# EAGLE design Moteino (EAGLE 6.5.0)
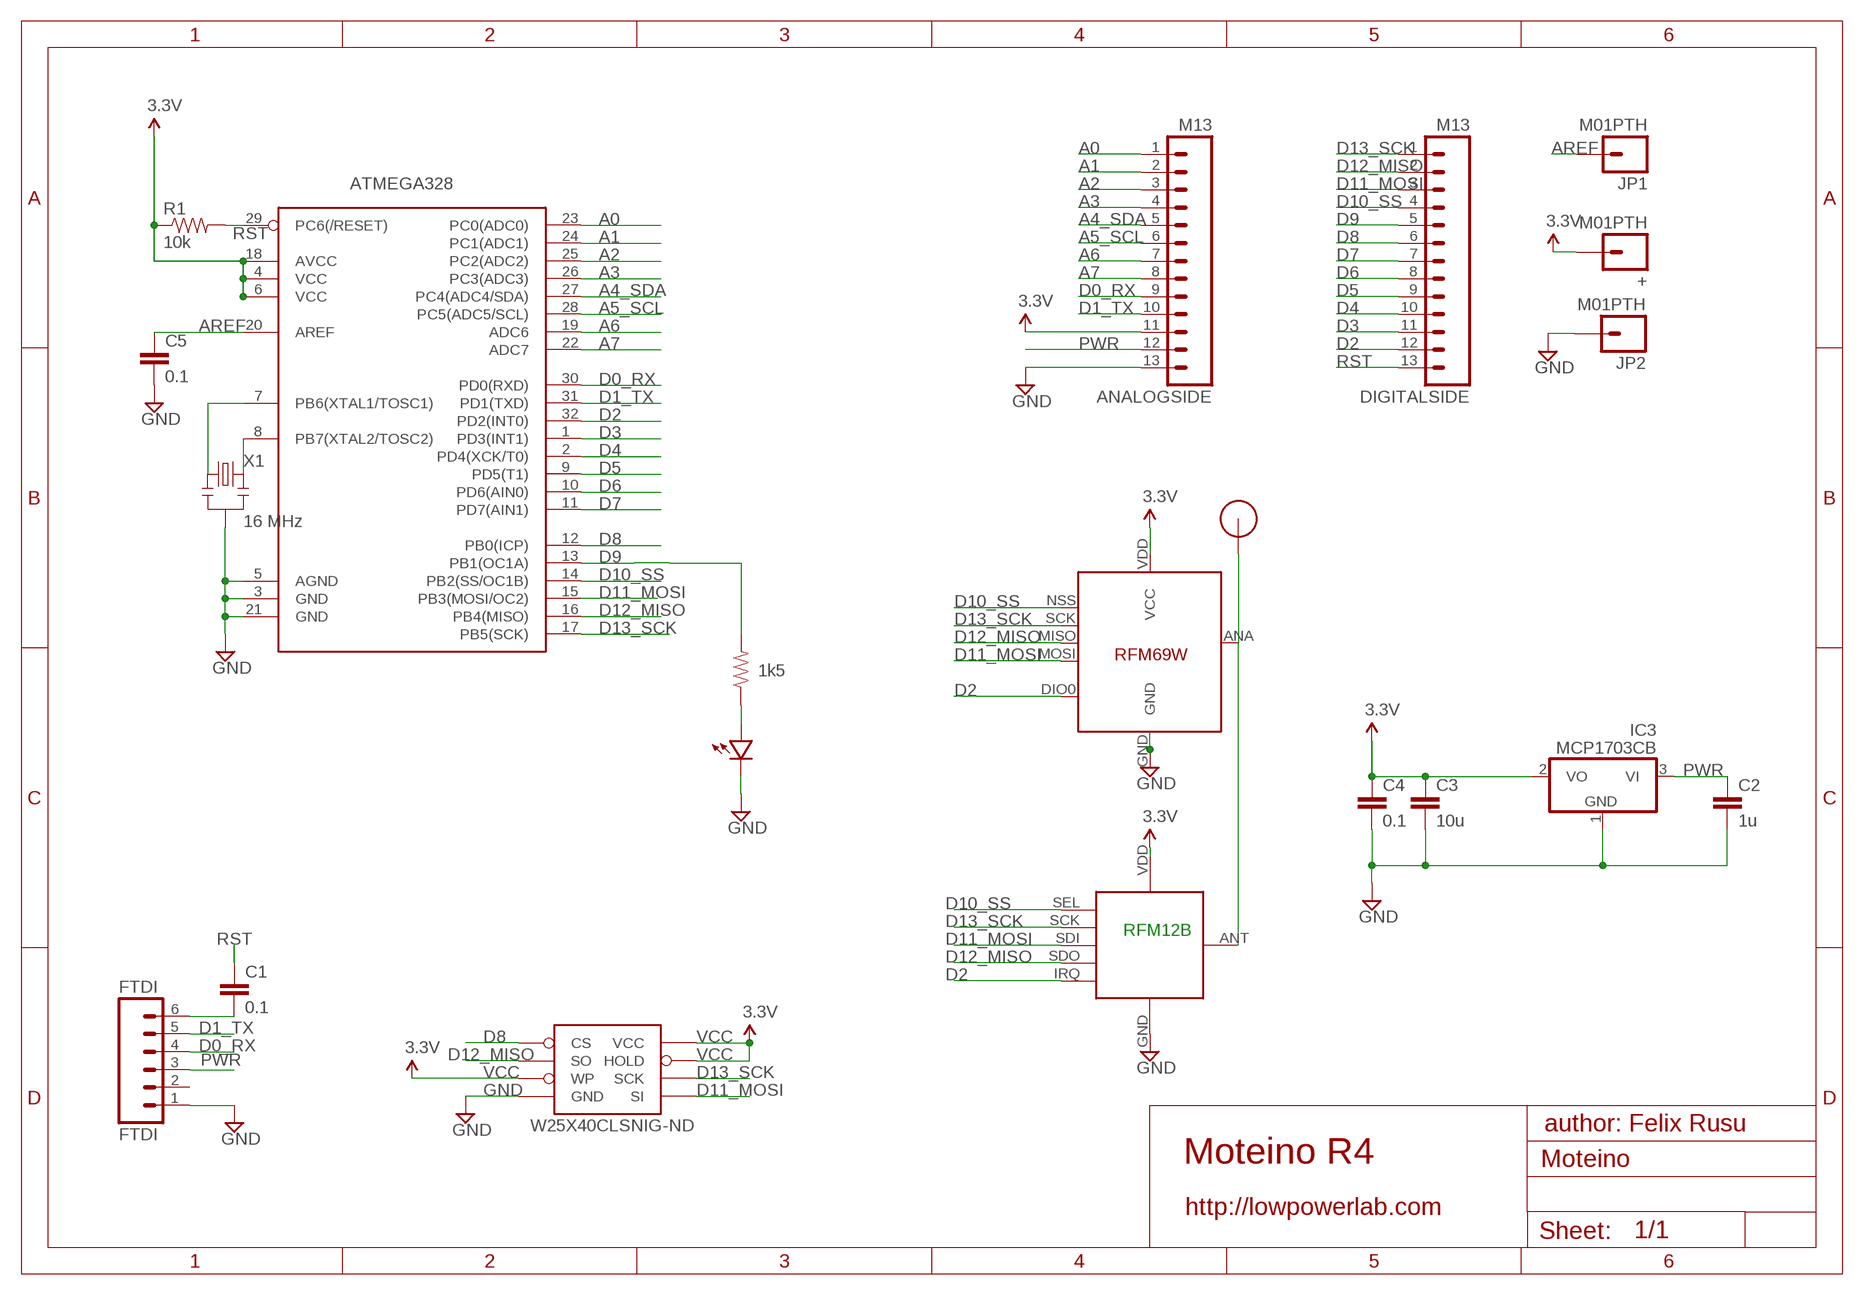
[diagram p0: schematic, sheet 1]

## Parts
+  M01PTH  [1X01]
ANALOGSIDE  M13  [1X13]
ATMEGA328  ATMega-328  ATMEGA168/328TQFP32  [TQFP32-08]
C1  0.1  CAP0603-CAP  [0603-CAP]
C2  1u  CAP0603-CAP  [0603-CAP]
C3  10u  CAP0805-CAP  [0805-CAP]
C4  0.1  CAP0603-CAP  [0603-CAP]
C5  0.1  CAP0603-CAP  [0603-CAP]
DIGITALSIDE  M13  [1X13]
FTDI  FTDI  M06SIP  [1X06]
IC3  MCP1703CB  [SOT23]
JP1  M01PTH  [1X01]
JP2  M01PTH  [1X01]
R1  10k  RESISTOR0603-RES  [0603-RES]
R2  1k5  RESISTOR0603-RES  [0603-RES]
RFM12B  RFM12B_MINPADS  [RFM12B-MINPADS]
U$1  RFM12B_ANTENNA  [RFM12B-ANTENNA]
U$2  LED0603  [0603-LED]
U$5  RFM69  [RFM69W-MINPADS]
W25X40CLSNIG-ND  AT25F512BWIDE_5.3MM  [SO08WIDE]
X1  16 MHz  RESONATORSMD  [RESONATOR-SMD]

## Nets
A0: ANALOGSIDE.1 ATMEGA328.23(PC0(ADC0))
A1: ANALOGSIDE.2 ATMEGA328.24(PC1(ADC1))
A2: ANALOGSIDE.3 ATMEGA328.25(PC2(ADC2))
A3: ANALOGSIDE.4 ATMEGA328.26(PC3(ADC3))
A4_SDA: ANALOGSIDE.5 ATMEGA328.27(PC4(ADC4/SDA))
A5_SCL: ANALOGSIDE.6 ATMEGA328.28(PC5(ADC5/SCL))
A6: ANALOGSIDE.7 ATMEGA328.19(ADC6)
A7: ANALOGSIDE.8 ATMEGA328.22(ADC7)
AREF: ATMEGA328.20(AREF) C5.1 JP1.1
D0_RX: ANALOGSIDE.9 ATMEGA328.30(PD0(RXD)) FTDI.4
D1_TX: ANALOGSIDE.10 ATMEGA328.31(PD1(TXD)) FTDI.5
D2: ATMEGA328.32(PD2(INT0)) DIGITALSIDE.12 RFM12B.IRQ U$5.DIO0
D3: ATMEGA328.1(PD3(INT1)) DIGITALSIDE.11
D4: ATMEGA328.2(PD4(XCK/T0)) DIGITALSIDE.10
D5: ATMEGA328.9(PD5(T1)) DIGITALSIDE.9
D6: ATMEGA328.10(PD6(AIN0)) DIGITALSIDE.8
D7: ATMEGA328.11(PD7(AIN1)) DIGITALSIDE.7
D8: ATMEGA328.12(PB0(ICP)) DIGITALSIDE.6 W25X40CLSNIG-ND.1(CS)
D9: ATMEGA328.13(PB1(OC1A)) DIGITALSIDE.5 R2.2
D10_SS: ATMEGA328.14(PB2(SS/OC1B)) DIGITALSIDE.4 RFM12B.SEL U$5.NSS(SEL)
D11_MOSI: ATMEGA328.15(PB3(MOSI/OC2)) DIGITALSIDE.3 RFM12B.SDI(SDI/MOSI) U$5.MOSI W25X40CLSNIG-ND.5(SI)
D12_MISO: ATMEGA328.16(PB4(MISO)) DIGITALSIDE.2 RFM12B.SDO(SDO/MISO) U$5.MISO W25X40CLSNIG-ND.2(SO)
D13_SCK: ATMEGA328.17(PB5(SCK)) DIGITALSIDE.1 RFM12B.SCK U$5.SCK W25X40CLSNIG-ND.6(SCK)
GND [power]: ANALOGSIDE.13 ATMEGA328.3(GND) ATMEGA328.5(AGND) ATMEGA328.21(GND) C2.2 C3.2 C4.2 C5.2 FTDI.1 IC3.1(GND) JP2.1 RFM12B.GND U$2.MINUS U$5.GND W25X40CLSNIG-ND.4(GND) X1.2
N$1: ATMEGA328.7(PB6(XTAL1/TOSC1)) X1.1
N$2: R2.1 U$2.PLUS
N$3: RFM12B.ANT U$1.P$1 U$5.ANA(ANT)
N$20: C1.2 FTDI.6
N$21: ATMEGA328.8(PB7(XTAL2/TOSC2)) X1.3
PWR [power]: ANALOGSIDE.12 C2.1 FTDI.3 IC3.3(VI)
RST: ATMEGA328.29(PC6(/RESET)) C1.1 DIGITALSIDE.13 R1.2
VCC: +.1 ANALOGSIDE.11 ATMEGA328.4(VCC) ATMEGA328.6(VCC) ATMEGA328.18(AVCC) C3.1 C4.1 IC3.2(VO) R1.1 RFM12B.VDD U$5.VDD(VCC) W25X40CLSNIG-ND.3(WP) W25X40CLSNIG-ND.7(HOLD) W25X40CLSNIG-ND.8(VCC) ; supply symbol labelled 3.3V
Unconnected: FTDI.2

## Notes on the sheet
- RFM12B
- author: Felix Rusu
- Moteino R4
- http://lowpowerlab.com

## Library data of the parts
+ JP1 JP2 = SparkFun-Connectors:M01: Header 1 Standard 1-pin 0.1" header. Use with straight break away headers (SKU : PRT-00116), right angle break away headers (PRT-00553), swiss pins (PRT-00743), machine pins (PRT-00117), and female headers (PRT-00115).
ANALOGSIDE DIGITALSIDE = SparkFun-Connectors:M13: 13-pin single row .1" header
ATMEGA328 = LowPowerLab:ATMEGA168/328: Atmel 32-pin 8-bit micro, 16k flash.
C1-C5 = LowPowerLab:CAP: Capacitor Standard 0603 ceramic capacitor, and 0.1" leaded capacitor.
FTDI = SparkFun-Connectors:M06: Header 6 Standard 6-pin 0.1" header. Use with straight break away headers (SKU : PRT-00116), right angle break away headers (PRT-00553), swiss pins (PRT-00743), machine pins (PRT-00117), and female headers (PRT-00115). Molex polarized connector foot print use with SKU : PRT-08094 with associated crimp pins and housings. NOTES ON THE VARIANTS LOCK and LOCK_LONGPADS... This footprint was designed to help hold the alignment of a through-hole component (i.e. 6-pin header) while soldering it into place. You may notice that each hole has been shifted either up or down by 0.005 of an inch from it's more standard position (which is a perfectly straight line). This slight alteration caused the pins (the squares in the middle) to touch the edges of the holes. Because they are alternating, it causes a "brace" to hold the component in place. 0.005 has proven to be the perfect amount of "off-center" position when using our standard breakaway headers. Although looks a little odd when you look at the bare footprint, once you have a header in there, the alteration is very hard to notice. Also, if you push a header all the way into place, it is covered up entirely on the bottom side. This idea of altering the position of holes to aid alignment will be further integrated into the Sparkfun Library for other footprints. It can help hold any component with 3 or more connection pins.
IC3 = linear:MCP1703: 250 mA, 16V, Low Quiescent Current LDO Regulator Source: http://ww1.microchip.com/downloads/en/DeviceDoc/22049b.pdf
R1 R2 = LowPowerLab:RESISTOR: Resistor Basic schematic elements and footprints for 0603, 1206, and PTH resistors.
RFM12B = LowPowerLab:RFM12B_MINPADS
U$1 = LowPowerLab:RFM12B_ANTENNA
U$2 = LowPowerLab:LED
U$5 = LowPowerLab:RFM69
W25X40CLSNIG-ND = LowPowerLab:AT25F512B: 4-Mbit SPI flash memory
X1 = SparkFun:RESONATOR: Resonator Small SMD resonator. This is the itty bitty 10/20MHz resonators with built in caps. CSTCE10M0G55 and CSTCE20M0V53. Footprint has been reviewed closely but hasn't been tested yet.

## Net classes
1 power: width 0.381 mm, clearance 0.254 mm

## Board
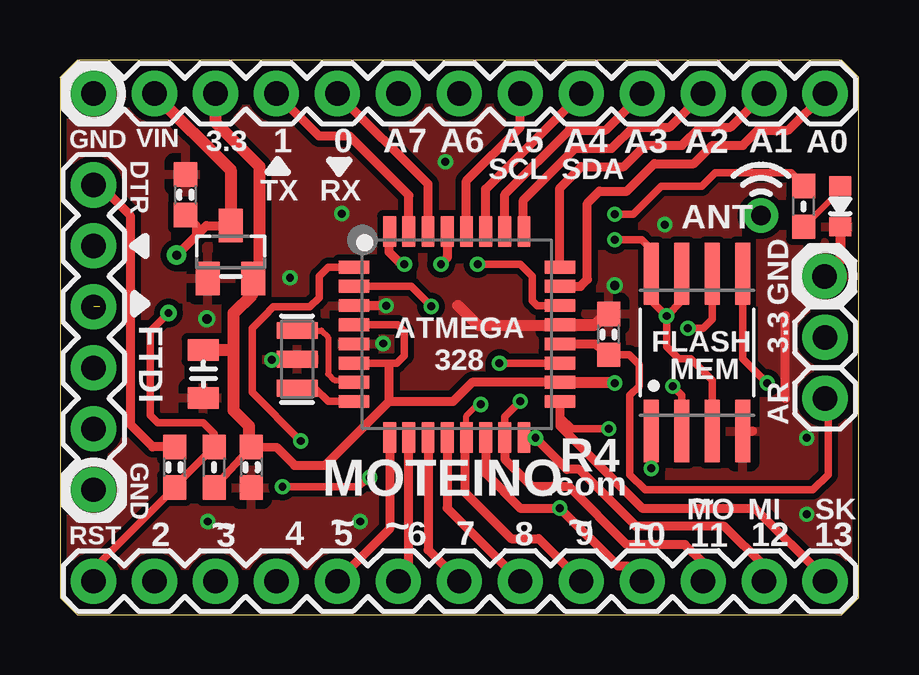
[diagram p1: board, top side]
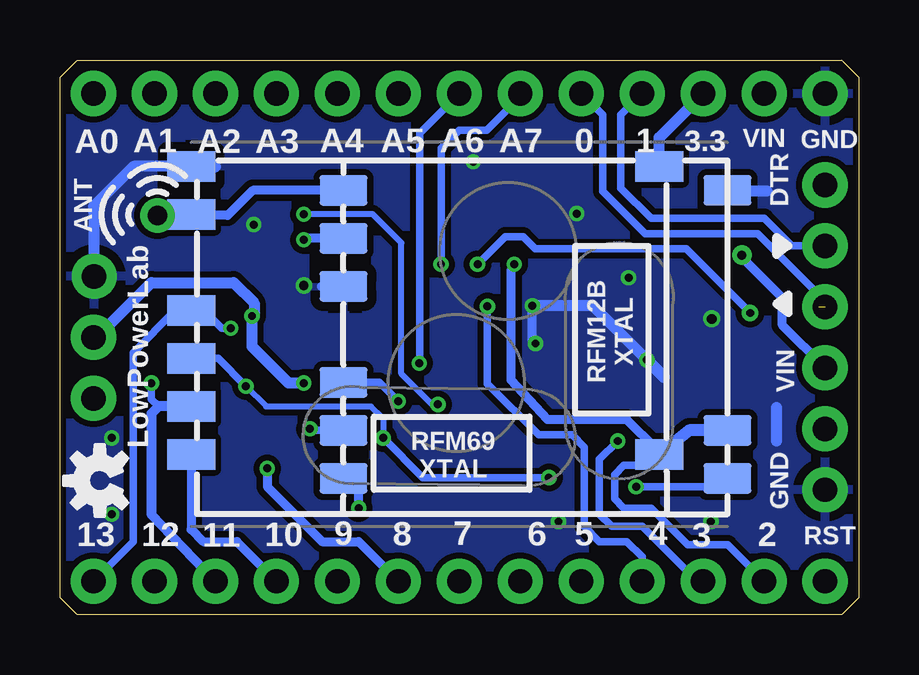
[diagram p2: board, bottom side, seen from below]

Size 33.27 x 23.11 mm. Coordinates in mm from the lower left corner, seen from the top.
Outline: 0.71,0 32.56,0 33.27,0.71 33.27,22.4 32.56,23.11 0.71,23.11 0,22.4 0,0.71 0.71,0
Copper layers (1*16): Top 0.035mm / dielectric 1.5mm / Bottom 0.035mm
Design rules "ITEADstudio_DRC *": minimum track width 6mil, minimum drill 12mil, track to track 6mil, track to pad 6mil, pad to pad 6mil, via to via 6mil, smd to smd 0mil, copper to edge 10mil, drill to drill 10mil, minimum pad ring 10mil, minimum via ring 6mil, stop-mask expansion 2mil, vias tented up to drill 100mil, thermal gap 15mil
tRestrict: area 24.3,8.9 to 29.1,12.8; area 5.8,16.9 to 6.9,18.5; area 5.2,9.7 to 6.7,10.4
bRestrict: area 27.4,17.7 to 29.2,18.7; area 21.1,13.8 to 22.9,14.9; area 21.6,12.6 to 22.1,13.2; area 20.7,12.6 to 21.2,13.2; area 20.2,12.8 to 20.7,13.5; area 20.1,13.4 to 20.6,14; area 26.5,18.9 to 27.1,19.5; area 26.5,17.9 to 27.1,18.5; area 27.5,19.1 to 28,19.8; area 27.9,18.8 to 29.1,19.6

### Footprints (pad centres in the part's own frame; a part is rotated, then mirrored left to right if it is on the bottom)
1X01 = drill 1.016 pad 1.88: 1 0,0
1X13 = drill 1.016 pad 1.88: 1 0,0; 2 2.54,0; 3 5.08,0; 4 7.62,0; 5 10.16,0; 6 12.7,0; 7 15.24,0; 8 17.78,0; 9 20.32,0; 10 22.86,0; 11 25.4,0; 12 27.94,0; 13 30.48,0
TQFP32-08 = smd 1.27 x 0.533: 1 -4.293,2.8; 2 -4.293,2; 3 -4.293,1.2; 4 -4.293,0.4; 5 -4.293,-0.4; 6 -4.293,-1.2; 7 -4.293,-2; 8 -4.293,-2.8; 17 4.293,-2.8; 18 4.293,-2; 19 4.293,-1.2; 20 4.293,-0.4; 21 4.293,0.4; 22 4.293,1.2; 23 4.293,2; 24 4.293,2.8 | smd 0.533 x 1.27: 9 -2.8,-4.293; 10 -2,-4.293; 11 -1.2,-4.293; 12 -0.4,-4.293; 13 0.4,-4.293; 14 1.2,-4.293; 15 2,-4.293; 16 2.8,-4.293; 25 2.8,4.293; 26 2,4.293; 27 1.2,4.293; 28 0.4,4.293; 29 -0.4,4.293; 30 -1.2,4.293; 31 -2,4.293; 32 -2.8,4.293
0603-CAP = smd 1.016 x 0.965: 1 -0.85,0; 2 0.85,0
0805-CAP = smd 0.902 x 1.3: 1 -1,0; 2 1,0
1X06 = drill 1.016 pad 1.88: 1 0,0; 2 2.54,0; 3 5.08,0; 4 7.62,0; 5 10.16,0; 6 12.7,0
SOT23 = smd 1 x 1.4: 1 -0.95,-1.1; 2 0.95,-1.1; 3 0,1.1
0603-RES = smd 1.016 x 0.965: 1 -0.85,0; 2 0.85,0
RFM12B-MINPADS = smd 2 x 1.27: ANT 8,-6; GND 8,-2; IRQ -8,4; SCK 8,4; SDI 8,2; SDI1 -8.002,-6.001; SDO -8,6; SEL 8,6; VDD 8,-4
RFM12B-ANTENNA = drill 0.8 pad 1.422: P$1 0,0
0603-LED = smd 0.8 x 0.9: MINUS -0.85,0; PLUS 0.85,0
RFM69W-MINPADS = smd 2 x 1.27: ANA 8,-5; DIO0 -11.5,5; GND 8,-7; MISO 8,1; MOSI 8,3; NSS 8,5; SCK 8,-1; VDD -11.5,-7
SO08WIDE = smd 0.61 x 2.6: 1 -1.905,-3.269; 2 -0.635,-3.269; 3 0.635,-3.269; 4 1.905,-3.269; 5 1.905,3.286; 6 0.635,3.286; 7 -0.635,3.286; 8 -1.905,3.286
RESONATOR-SMD = smd 0.7 x 1.7: 1 -1.2,0; 2 0,0; 3 1.2,0

### Placement (x,y rotation side)
+  31.88,11.56 270 top
ANALOGSIDE  31.88,21.72 180 top
ATMEGA328  16.54,11.68 0 top
C1  4.78,6.15 90 top
C2  5.23,17.5 90 top
C3  5.97,10.03 270 top
C4  7.98,6.15 270 top
C5  22.86,11.68 90 top
DIGITALSIDE  31.88,1.4 180 top
FTDI  1.4,5.21 90 top
IC3  7.11,15.11 0 top
JP1  31.88,9.02 0 top
JP2  31.85,14.1 0 top
R1  6.43,6.15 90 top
R2  30.99,17.02 90 top
RFM12B  13.46,11.68 180 bottom
U$1  29.21,16.64 0 top
U$2  32.51,17.02 90 top
U$3  [OSHW-LOGO-S]  31.62,5.59 90 bottom
U$5  19.81,11.68 180 bottom
W25X40CLSNIG-ND  26.54,10.92 0 top
X1  9.88,10.64 270 top

### Tracks (layer width: path | path; a pad name or v marks a point on that pad's centre or on a via)
A0
  Top 0.381: ATMEGA328.23 21.68,13.68 21.97,13.97 21.97,17.14 22.48,17.65 23.62,17.65 24.77,18.8 26.42,18.8 27.18,19.56 28.45,19.56 29.08,20.19 30.35,20.19 ANALOGSIDE.1
A1
  Top 0.381: ATMEGA328.24 20.83,17.78 21.72,18.67 23.5,18.67 24.38,19.56 25.91,19.56 26.67,20.32 27.94,20.32 ANALOGSIDE.2
A2
  Top 0.381: ATMEGA328.25 19.3,15.98 19.3,17.27 21.46,19.43 22.99,19.43 23.88,20.32 25.4,20.32 ANALOGSIDE.3
A3
  Top 0.381: ATMEGA328.26 18.54,17.52 21.21,20.19 22.73,20.19 ANALOGSIDE.4
A4_SDA
  Top 0.381: ATMEGA328.27 17.73,17.73 ANALOGSIDE.5
A5_SCL
  Top 0.381: ATMEGA328.28 16.93,18.08 19.18,20.32 ANALOGSIDE.6
A6  (via drill 0.33)
  Top 0.305: ATMEGA328.19 v18.31,10.48
  Bottom 0.305: 18.29,10.41 18.29,20.07 ANALOGSIDE.7
  Bottom 0.381: 18.29,10.41 v18.31,10.48
A7  (via drill 0.33)
  Top 0.305: ATMEGA328.22 19.88,12.88 19.68,13.08 19.68,14.1 19.18,14.61 v17.4,14.61
  Bottom 0.305: v17.4,14.61 17.4,19.43 16.64,20.19 15.49,20.19 14.1,21.59 ANALOGSIDE.8
AREF
  Top 0.305: C5.1 23.71,10.83 24.13,10.41 24.13,9.53 23.75,9.14 23.75,5.84 24.38,5.21 31.37,5.21 32,5.84 32,8.89 JP1.1
  Top 0.381: ATMEGA328.20 22.28,11.28 C5.1
D0_RX  (1 unrouted)
  Top 0.381: ATMEGA328.30 15.34,17.94 ANALOGSIDE.9
  Bottom 0.305: 1.65,12.83 1.65,13.34 4.19,15.88 8.89,15.88 10.67,17.65 10.67,20.83 ANALOGSIDE.9
D1_TX
  Top 0.381: ATMEGA328.31 14.54,17.47 12.06,19.94 10.79,19.94 ANALOGSIDE.10
  Bottom 0.305: FTDI.5 2.79,15.37 3.94,16.51 8.64,16.51 9.91,17.78 9.91,20.83 ANALOGSIDE.10
D2  (via drill 0.33)
  Top 0.381: v14.35,14.61 14.22,14.61 13.72,15.11 13.72,15.83 ATMEGA328.32
  Bottom 0.305: DIGITALSIDE.12 5.46,2.92 7.11,2.92 8.64,4.45 9.78,4.45 10.16,4.83 10.16,5.84 9.78,6.22 8.77,6.22 U$5.DIO0
  Bottom 0.381: 7.85,6.89 8.41,6.89 9.65,8.13 12.95,8.13 14.48,9.78 14.48,14.35 v14.35,14.61
  Bottom 0.406: U$5.DIO0 8.05,6.68 7.85,6.89
  Bottom 0.508: RFM12B.IRQ 7.06,7.68 U$5.DIO0
D3  (via drill 0.33)
  Top 0.305: v10.03,7.24 8,9.27 8,11.05 8,11.94 8.51,12.45 8.89,12.83 10.41,12.83 10.79,13.21 10.79,14.1 11.18,14.48 ATMEGA328.1
  Top 0.381: ATMEGA328.1
  Bottom 0.305: DIGITALSIDE.11 6.73,1.4 9.02,3.68 10.29,3.68 10.79,4.19 10.79,6.48 v10.03,7.24
D4  (via drill 0.33)
  Top 0.305: ATMEGA328.2 14.63,13.68 v15.46,12.85
  Top 0.381: 12.17,13.73 ATMEGA328.2
  Bottom 0.305: DIGITALSIDE.10 9.02,2.41 9.65,3.05 10.79,3.05 11.43,3.68 11.43,6.99 11.94,7.49 13.34,7.49 15.46,9.62 v15.46,12.85
D5
  Top 0.381: ATMEGA328.9 13.73,3.58 DIGITALSIDE.9
D6
  Top 0.381: DIGITALSIDE.8 14.54,1.83 ATMEGA328.10
D7
  Top 0.381: ATMEGA328.11 15.34,2.7 DIGITALSIDE.7
D8  (via drill 0.33)
  Top 0.305: v24.64,6.1 24.62,7.75 W25X40CLSNIG-ND.1
  Top 0.381: ATMEGA328.12 16.14,4.44 DIGITALSIDE.6
  Bottom 0.381: v24.64,6.1 24.64,5.33 22.35,3.05 20.83,3.05 DIGITALSIDE.6
D9  (via drill 0.33)
  Top 0.254: ATMEGA328.13 16.93,8.3 17.4,8.76 v17.53,8.76
  Top 0.305: R2.2 30.77,18.12 30.48,18.41 27.3,18.41 26.75,17.86 25.04,17.86 23.88,16.69 v23.11,16.69
  Top 0.381: ATMEGA328.13 16.89,7.31 16.89,5.08 18.8,3.17 19.94,3.17 DIGITALSIDE.5
  Bottom 0.254: v17.53,8.76 17.78,8.76 19.05,10.03 19.05,15.49 20.24,16.69 v23.11,16.69
D10_SS  (via drill 0.33)
  Top 0.381: ATMEGA328.14 17.73,5.89 19.18,4.45 v20.83,4.45 23.24,2.03 23.62,2.03 DIGITALSIDE.4
  Bottom 0.254: 20.83,5.43 RFM12B.SEL
  Bottom 0.381: v20.83,4.45 20.83,5.43 | U$5.NSS 27.81,3.56 27.3,3.05 25.91,3.05 DIGITALSIDE.4
D11_MOSI  (via drill 0.33)
  Top 0.305: v29.46,9.65 28.45,10.67 W25X40CLSNIG-ND.5 | ATMEGA328.15 18.54,8.25 v19.18,8.89
  Top 0.381: ATMEGA328.15 18.54,6.48 19.68,5.33 21.21,5.33 23.62,2.92 26.04,2.92 26.8,2.16 DIGITALSIDE.3
  Bottom 0.305: v29.46,9.65 29.46,8.99 29.16,8.68 | v19.18,8.89 19.97,9.68 RFM12B.SDI
  Bottom 0.381: DIGITALSIDE.3 29.46,4.19
  Bottom 0.406: U$5.MOSI 29.16,8.68 29.46,8.38 29.46,4.19
D12_MISO  (via drill 0.33)
  Top 0.305: v25.53,9.53 25.91,9.14 25.91,8.51 W25X40CLSNIG-ND.2 | v9.27,5.33 12.39,5.33 v12.9,5.71
  Top 0.381: ATMEGA328.16 19.91,7.39 v19.81,7.37 21.12,6.06 21.63,6.06 24,3.68 27.69,3.68 29.34,2.03 DIGITALSIDE.2
  Bottom 0.254: v25.53,9.53 24.69,8.69 20.32,8.69 19.81,8.18 v19.81,7.37
  Bottom 0.305: U$5.MISO 26.69,10.68 v25.53,9.53 25.84,9.84 | v19.81,7.37 18.16,5.71 v12.9,5.71 | v9.27,5.33 5.81,5.33 RFM12B.SDO
D13_SCK  (via drill 0.33)
  Top 0.305: v26.16,11.94 26.8,11.94 27.18,12.32 W25X40CLSNIG-ND.6 | v22.86,7.75 21.34,7.75 20.83,8.26
  Top 0.381: DIGITALSIDE.1 31.88,1.52 28.96,4.45 24.25,4.45 20.83,7.87 20.83,8.26 ATMEGA328.17
  Bottom 0.305: RFM12B.SCK 22.8,7.68 v22.86,7.75 | DIGITALSIDE.1 30.23,3.05 30.23,10.92 28.46,12.68 U$5.SCK 27.8,12.7 27.3,12.7 26.54,11.94 v26.16,11.94
GND  (via drill 0.33, 0.38, 0.41)
  Top 0.381: 20.94,12.06 ATMEGA328.21 | v13.59,12.88 ATMEGA328.3 | 16.53,12.88 16.59,12.88 | W25X40CLSNIG-ND.4 28.86,7.65 | 30.23,9.02 30.23,12.47 | v8.82,10.62 X1.2
  Top 0.406: U$2.MINUS 32.51,14.76 JP2.1
  Top 0.457: 20.94,12.06 17.4,12.06 16.59,12.88
  Top 0.508: ATMEGA328.21 22.28,12.08 C5.2 22.99,12.41
  Bottom 0.381: 13.59,12.81 v13.59,12.88 13.59,11.3 v13.46,11.3 | RFM12B.GND 22.38,13.68
  Bottom 0.457: 31.88,14.12 JP2.1 31.88,14.12 | 26.81,18.68 30.21,18.68 31.88,17.02 31.88,14.12 | v8.82,10.62 11.08,12.88 v13.59,12.88 | 3.43,8.64 3.43,7.24 | 3.81,17.65 5.31,17.65
  Bottom 0.508: U$5.GND 26.81,18.68 | 8.11,9.91 v8.82,10.62
  other vias: 6.12,12.32 23.11,13.72 6.15,3.89 12.5,3.89 9.58,14.05 11.74,16.71 16.06,18.87 25.2,16.26 31.11,7.37 31.11,4.19
  pour Bottom: -0.64,24 -0.64,-0.76 34.04,-0.76 34.04,24
  pour Top: -0.64,24 -0.64,-0.76 34.04,-0.76 34.04,24
N$1
  Top 0.254: X1.1 10.89,11.84 11.18,11.56 11.18,10.03 11.43,9.78 12.15,9.78 ATMEGA328.7
N$2
  Top 0.254: R2.1 32.38,17.57 U$2.PLUS
N$3
  Bottom 0.381: U$1.P$1 28.5,16.68 U$5.ANA 27.51,16.64 26.29,16.64 25.24,17.68 RFM12B.ANT
N$20
  Top 0.381: C1.2 3.86,7 2.92,7.94 2.92,16.64 1.65,17.91 FTDI.6
N$21
  Top 0.254: ATMEGA328.8
  Top 0.305: X1.3 10.62,9.44 11.18,8.89 ATMEGA328.8
PWR  (via drill 0.38 pad 0.81)
  Top 0.381: v4.86,14.98 5.67,15.79 | 5.67,15.79 6.09,16.21 IC3.3 | C2.1 5.67,16.21 5.67,15.79
  Top 0.508: ANALOGSIDE.12 7.11,18.54 IC3.3
  Bottom 0.381: FTDI.3 3.17,12.06 3.17,13.21 4.99,15.02 v4.86,14.98
RST  (via drill 0.33, 0.33 pad 0.69)
  Top 0.305: DIGITALSIDE.13 1.4,1.92 C1.1 4.78,5.35 R1.2 6.43,7.54 5.97,8 4.06,8 3.76,8.31 3.76,11.81 v4.52,12.57
  Top 0.381: ATMEGA328.29 16.14,14.87 v15.88,14.61
  Bottom 0.305: v15.88,14.61 14.73,15.75 13.97,15.75 13.46,15.24 7.19,15.24 v4.52,12.57
VCC  (via drill 0.33)
  Top 0.305: ATMEGA328.4 14.08,12.08 14.35,11.81 14.35,10.79 14.03,10.48 13.84,10.48 | ATMEGA328.6 13.84,10.48 | v25.27,12.45 24.64,13.08 W25X40CLSNIG-ND.8 | v25.27,12.45 25.91,13.08 W25X40CLSNIG-ND.7 | v25.27,12.45 25.27,11.18 25.78,10.67 26.29,10.67 27.18,9.78 W25X40CLSNIG-ND.3 | v23.11,15.62 24.24,15.62 24.64,15.22 | 13.72,10.36 13.84,10.48 | R1.1 6.43,5.32 C4.1
  Top 0.381: 24.64,15.22 W25X40CLSNIG-ND.8 | ATMEGA328.18 17.18,9.68 16.38,8.89 13.72,8.89 | 13.72,8.89 13.72,10.36 | C4.1 9.03,6.97 9.78,6.22 11.05,6.22 13.72,8.89
  Top 0.457: ATMEGA328.18 23.21,9.68 v23.11,9.65
  Top 0.508: 7.87,7.07 C4.1 7.87,7.07 | C3.1 6.24,11.03 7.22,11.03 7.24,11.05 | 7.87,7.07 7.87,7.87 7.24,8.51 7.24,11.05 | 7.24,11.05 7.24,12.57 8,13.34 8,13.95 IC3.2 | IC3.2 8.23,13.84 | ANALOGSIDE.11 6.48,20.52 U$5.VDD 8.31,14.26 IC3.2
  Top 0.635: 8.23,13.73 8.23,13.84
  Bottom 0.381: RFM12B.VDD 23.18,15.68 v23.11,15.62
  Bottom 0.457: +.1 31.75,11.56 29.46,13.84 26.04,13.84 25.18,12.99 25.18,12.54 v25.27,12.45 25.27,11.18 23.75,9.65 v23.11,9.65 | U$5.VDD 8.31,19.88 ANALOGSIDE.11

### Text on the board
tPlace: R4 | MOTEINO | .com
bPlace: RFM12B / XTAL | LowPowerLab | RFM69 / XTAL
tDocu: REG
_tsilk: VIN | 3.3 | 1 | 0 | A7 | A6 | A5 | A4 | A3 | A2 | A1 | GND | DTR | A0 | TX | RX | SCL | SDA | ANT | GND | 3.3 | FLASH | ATMEGA / 328 | MEM | AR | FTDI | GND | 2 | 3 | 4 | 5 | 6 | 7 | 8 | 9 | 10 | MO | ~ | 11 | MI | 12 | SK | 13 | RST | ~ | ~ | ~ | ~ | ~
_bsilk: VIN | 3.3 | 1 | 0 | A7 | A6 | A5 | A4 | A3 | A2 | A1 | A0 | GND | DTR | ANT | VIN | GND | 2 | 3 | 4 | 5 | 6 | 7 | 8 | 9 | 10 | 11 | 12 | 13 | RST